# EAGLE design MCP23017_O8_v1_01 (EAGLE 9.6.2)
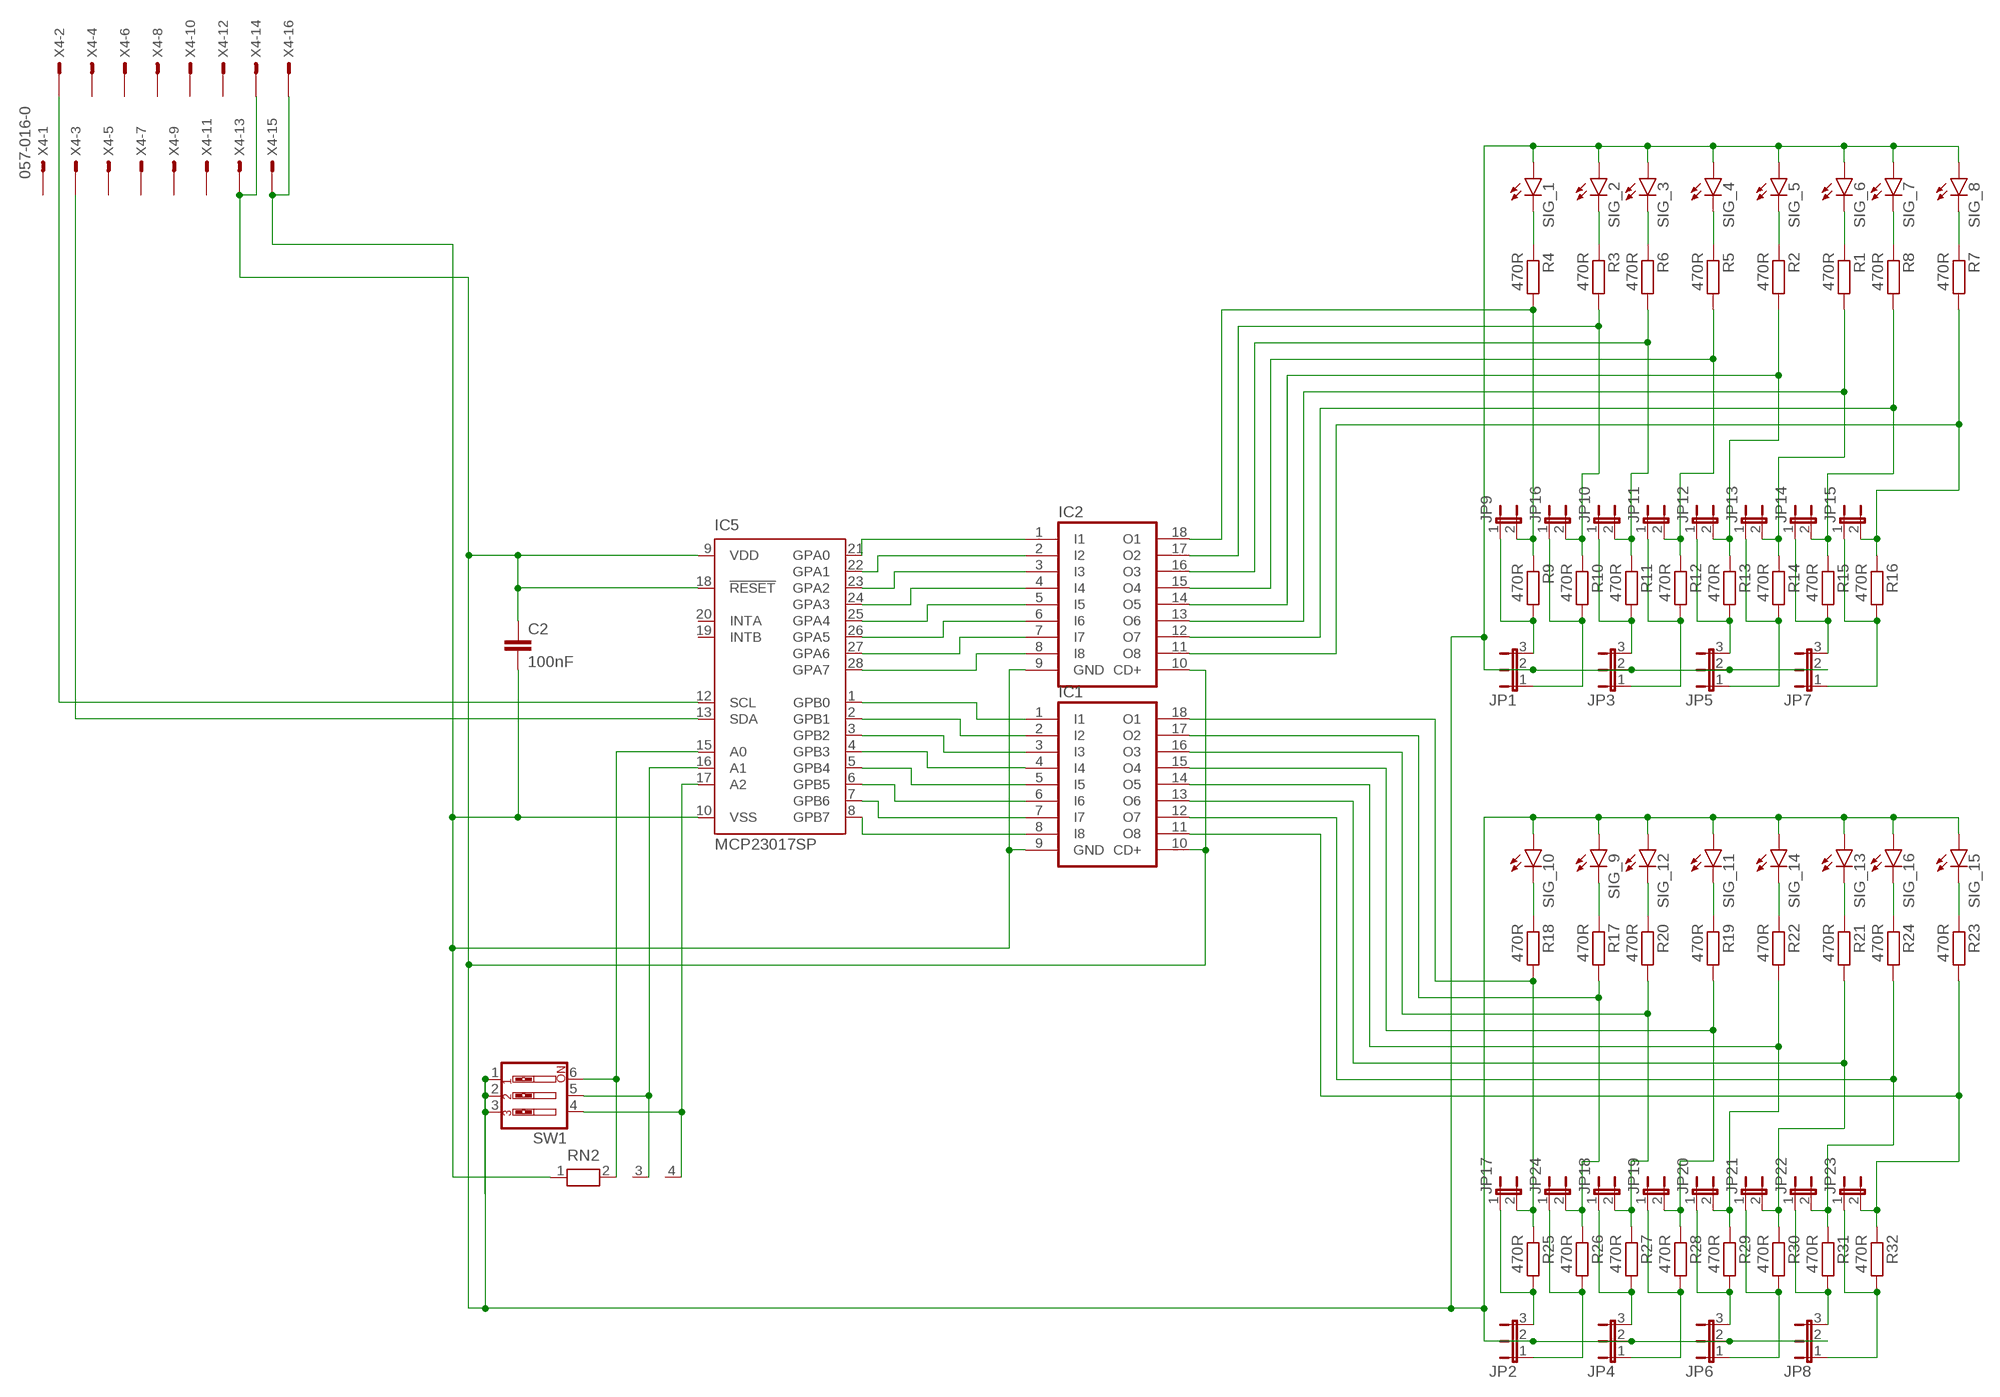
[diagram p0: schematic, sheet 1]

## Parts
C2  100nF  C-EU025-024X044  [C025-024X044]
IC1  ULN2803A  [DIL18]
IC2  ULN2803A  [DIL18]
IC5  MCP23017SP  [DIL28-3]
JP1  JP2E  [JP2]
JP2  JP2E  [JP2]
JP3  JP2E  [JP2]
JP4  JP2E  [JP2]
JP5  JP2E  [JP2]
JP6  JP2E  [JP2]
JP7  JP2E  [JP2]
JP8  JP2E  [JP2]
JP9  JP1E  [JP1]
JP10  JP1E  [JP1]
JP11  JP1E  [JP1]
JP12  JP1E  [JP1]
JP13  JP1E  [JP1]
JP14  JP1E  [JP1]
JP15  JP1E  [JP1]
JP16  JP1E  [JP1]
JP17  JP1E  [JP1]
JP18  JP1E  [JP1]
JP19  JP1E  [JP1]
JP20  JP1E  [JP1]
JP21  JP1E  [JP1]
JP22  JP1E  [JP1]
JP23  JP1E  [JP1]
JP24  JP1E  [JP1]
R1  470R  R-EU_0309/10  [0309/10]
R2  470R  R-EU_0309/10  [0309/10]
R3  470R  R-EU_0309/10  [0309/10]
R4  470R  R-EU_0309/10  [0309/10]
R5  470R  R-EU_0309/10  [0309/10]
R6  470R  R-EU_0309/10  [0309/10]
R7  470R  R-EU_0309/10  [0309/10]
R8  470R  R-EU_0309/10  [0309/10]
R9  470R  R-EU_0309/10  [0309/10]
R10  470R  R-EU_0309/10  [0309/10]
R11  470R  R-EU_0309/10  [0309/10]
R12  470R  R-EU_0309/10  [0309/10]
R13  470R  R-EU_0309/10  [0309/10]
R14  470R  R-EU_0309/10  [0309/10]
R15  470R  R-EU_0309/10  [0309/10]
R16  470R  R-EU_0309/10  [0309/10]
R17  470R  R-EU_0309/10  [0309/10]
R18  470R  R-EU_0309/10  [0309/10]
R19  470R  R-EU_0309/10  [0309/10]
R20  470R  R-EU_0309/10  [0309/10]
R21  470R  R-EU_0309/10  [0309/10]
R22  470R  R-EU_0309/10  [0309/10]
R23  470R  R-EU_0309/10  [0309/10]
R24  470R  R-EU_0309/10  [0309/10]
R25  470R  R-EU_0309/10  [0309/10]
R26  470R  R-EU_0309/10  [0309/10]
R27  470R  R-EU_0309/10  [0309/10]
R28  470R  R-EU_0309/10  [0309/10]
R29  470R  R-EU_0309/10  [0309/10]
R30  470R  R-EU_0309/10  [0309/10]
R31  470R  R-EU_0309/10  [0309/10]
R32  470R  R-EU_0309/10  [0309/10]
RN2  RN03  [RN-3]
SIG_1  LED3MM  [LED3MM]
SIG_2  LED3MM  [LED3MM]
SIG_3  LED3MM  [LED3MM]
SIG_4  LED3MM  [LED3MM]
SIG_5  LED3MM  [LED3MM]
SIG_6  LED3MM  [LED3MM]
SIG_7  LED3MM  [LED3MM]
SIG_8  LED3MM  [LED3MM]
SIG_9  LED3MM  [LED3MM]
SIG_10  LED3MM  [LED3MM]
SIG_11  LED3MM  [LED3MM]
SIG_12  LED3MM  [LED3MM]
SIG_13  LED3MM  [LED3MM]
SIG_14  LED3MM  [LED3MM]
SIG_15  LED3MM  [LED3MM]
SIG_16  LED3MM  [LED3MM]
SW1  SW_DIP-3  [EDG-03]
X4  057-016-0  [057-016-0]

## Nets
GND2: C2.2 IC1.9(GND) IC2.9(GND) IC5.10(VSS) RN2.1 X4.15 X4.16
N$1: JP1.3 JP9.1 R9.2
N$2: IC2.18(O1) JP9.2 R4.2 R9.1
N$3: R2.1 SIG_5.K(C)
N$4: R1.1 SIG_6.K(C)
N$5: IC2.1(I1) IC5.21(GPA0)
N$6: IC5.17(A2) RN2.4 SW1.4
N$7: R8.1 SIG_7.K(C)
N$8: R7.1 SIG_8.K(C)
N$9: JP1.1 JP16.1 R10.2
N$10: JP3.3 JP10.1 R11.2
N$11: JP3.1 JP11.1 R12.2
N$12: IC2.16(O3) JP10.2 R6.2 R11.1
N$13: JP5.3 JP12.1 R13.2
N$14: IC2.14(O5) JP12.2 R2.2 R13.1
N$16: IC1.17(O2) JP24.2 R17.2 R26.1
N$17: IC1.15(O4) JP19.2 R19.2 R28.1
N$18: IC1.14(O5) JP20.2 R22.2 R29.1
N$20: IC1.18(O1) JP17.2 R18.2 R25.1
N$22: IC2.17(O2) JP16.2 R3.2 R10.1
N$24: IC2.15(O4) JP11.2 R5.2 R12.1
N$25: IC2.2(I2) IC5.22(GPA1)
N$27: IC2.3(I3) IC5.23(GPA2)
N$29: IC2.4(I4) IC5.24(GPA3)
N$30: JP5.1 JP13.1 R14.2
N$31: IC2.5(I5) IC5.25(GPA4)
N$32: JP7.3 JP14.1 R15.2
N$33: JP7.1 JP15.1 R16.2
N$34: IC2.6(I6) IC5.26(GPA5)
N$35: IC5.16(A1) RN2.3 SW1.5
N$36: R4.1 SIG_1.K(C)
N$37: R3.1 SIG_2.K(C)
N$38: IC2.7(I7) IC5.27(GPA6)
N$39: IC2.8(I8) IC5.28(GPA7)
N$40: IC1.1(I1) IC5.1(GPB0)
N$41: IC1.2(I2) IC5.2(GPB1)
N$42: IC1.3(I3) IC5.3(GPB2)
N$43: IC1.4(I4) IC5.4(GPB3)
N$44: IC1.5(I5) IC5.5(GPB4)
N$45: IC1.6(I6) IC5.6(GPB5)
N$46: IC1.7(I7) IC5.7(GPB6)
N$47: IC1.8(I8) IC5.8(GPB7)
N$50: IC1.13(O6) JP21.2 R21.2 R30.1
N$51: IC1.16(O3) JP18.2 R20.2 R27.1
N$52: IC1.12(O7) JP22.2 R24.2 R31.1
N$53: R6.1 SIG_3.K(C)
N$54: R5.1 SIG_4.K(C)
N$55: IC1.11(O8) JP23.2 R23.2 R32.1
N$57: IC2.13(O6) JP13.2 R1.2 R14.1
N$58: IC2.12(O7) JP14.2 R8.2 R15.1
N$59: IC2.11(O8) JP15.2 R7.2 R16.1
N$61: R18.1 SIG_10.K(C)
N$62: R17.1 SIG_9.K(C)
N$66: R20.1 SIG_12.K(C)
N$67: R19.1 SIG_11.K(C)
N$69: R22.1 SIG_14.K(C)
N$70: R21.1 SIG_13.K(C)
N$72: R24.1 SIG_16.K(C)
N$73: R23.1 SIG_15.K(C)
N$74: JP2.3 JP17.1 R25.2
N$75: JP2.1 JP24.1 R26.2
N$76: JP4.3 JP18.1 R27.2
N$77: JP4.1 JP19.1 R28.2
N$78: JP6.3 JP20.1 R29.2
N$79: JP6.1 JP21.1 R30.2
N$80: JP8.3 JP22.1 R31.2
N$81: JP8.1 JP23.1 R32.2
N$82: IC5.12(SCL) X4.2
N$84: IC5.13(SDA) X4.3
N$85: IC5.15(A0) RN2.2 SW1.6
VCC5.1: C2.1 IC1.10(CD+) IC2.10(CD+) IC5.9(VDD) IC5.18(!RESET) JP1.2 JP2.2 JP3.2 JP4.2 JP5.2 JP6.2 JP7.2 JP8.2 SIG_1.A SIG_2.A SIG_3.A SIG_4.A SIG_5.A SIG_6.A SIG_7.A SIG_8.A SIG_9.A SIG_10.A SIG_11.A SIG_12.A SIG_13.A SIG_14.A SIG_15.A SIG_16.A SW1.1 SW1.2 SW1.3 X4.13 X4.14
Unconnected: IC5.19(INTB) IC5.20(INTA) X4.1 X4.4 X4.5 X4.6 X4.7 X4.8 X4.9 X4.10 X4.11 X4.12

## Library data of the parts
C2 = resistor:C-EU: CAPACITOR, European symbol
IC1 IC2 = uln-udn:ULN2803A: DRIVER ARRAY
IC5 = microchip-6:MCP23017: http://ww1.microchip.com/downloads/en/DeviceDoc/21952a.pdf Source: http://ww1.microchip.com/downloads/en/DeviceDoc/21952a.pdf
JP1-JP8 = jumper:JP2E: JUMPER
JP9-JP24 = jumper:JP1E: JUMPER
R1-R32 = resistor:R-EU_: RESISTOR, European symbol
RN2 = resistor-net_edit:RN03: RESISTOR NETWORK; OC_FARNELL: unknown; OC_NEWARK: unknown
SIG_1-SIG_16 = led:LED: LED OSRAM: - CHIPLED LG R971, LG N971, LY N971, LG Q971, LY Q971, LO R971, LY R971 LH N974, LH R974 LS Q976, LO Q976, LY Q976 LO Q996 - Hyper CHIPLED LW Q18S LB Q993, LB Q99A, LB R99A - SideLED LS A670, LO A670, LY A670, LG A670, LP A670 LB A673, LV A673, LT A673, LW A673 LH A674 LY A675 LS A676, LA A676, LO A676, LY A676, LW A676 LS A679, LY A679, LG A679 - Hyper Micro SIDELED® LS Y876, LA Y876, LO Y876, LY Y876 LT Y87S - SmartLED LW L88C, LW L88S LB L89C, LB L89S, LG L890 LS L89K, LO L89K, LY L89K LS L896, LA L896, LO L896, LY L896 - TOPLED LS T670, LO T670, LY T670, LG T670, LP T670 LSG T670, LSP T670, LSY T670, LOP T670, LYG T670 LG T671, LOG T671, LSG T671 LB T673, LV T673, LT T673, LW T673 LH T674 LS T676, LA T676, LO T676, LY T676, LB T676, LH T676, LSB T676, LW T676 LB T67C, LV T67C, LT T67C, LS T67K, LO T67K, LY T67K, LW E67C LS E67B, LA E67B, LO E67B, LY E67B, LB E67C, LV E67C, LT E67C LW T67C LS T679, LY T679, LG T679 LS T770, LO T770, LY T770, LG T770, LP T770 LB T773, LV T773, LT T773, LW T773 LH T774 LS E675, LA E675, LY E675, LS T675 LS T776, LA T776, LO T776, LY T776, LB T776 LHGB T686 LT T68C, LB T68C - Hyper Mini TOPLED® LB M676 - Mini TOPLED Santana® LG M470 LS M47K, LO M47K, LY M47K Source: http://www.osram.convergy.de LUXEON: - LUMILED® LXK2-PW12-R00, LXK2-PW12-S00, LXK2-PW14-U00, LXK2-PW14-V00 LXK2-PM12-R00, LXK2-PM12-S00, LXK2-PM14-U00 LXK2-PE12-Q00, LXK2-PE12-R00, LXK2-PE12-S00, LXK2-PE14-T00, LXK2-PE14-U00 LXK2-PB12-K00, LXK2-PB12-L00, LXK2-PB12-M00, LXK2-PB14-N00, LXK2-PB14-P00, LXK2-PB14-Q00 LXK2-PR12-L00, LXK2-PR12-M00, LXK2-PR14-Q00, LXK2-PR14-R00 LXK2-PD12-Q00, LXK2-PD12-R00, LXK2-PD12-S00 LXK2-PH12-R00, LXK2-PH12-S00 LXK2-PL12-P00, LXK2-PL12-Q00, LXK2-PL12-R00 Source: www.luxeon.com KINGBRIGHT: KA-3528ASYC Source: www.kingbright.com
SW1 = special:SW_DIP-3: DIP SWITCH
X4 = con-panduit:057-016-: CONNECTOR 10-pin series 057 contact pc board low profile headers; OC_FARNELL: unknown; OC_NEWARK: unknown

## Board
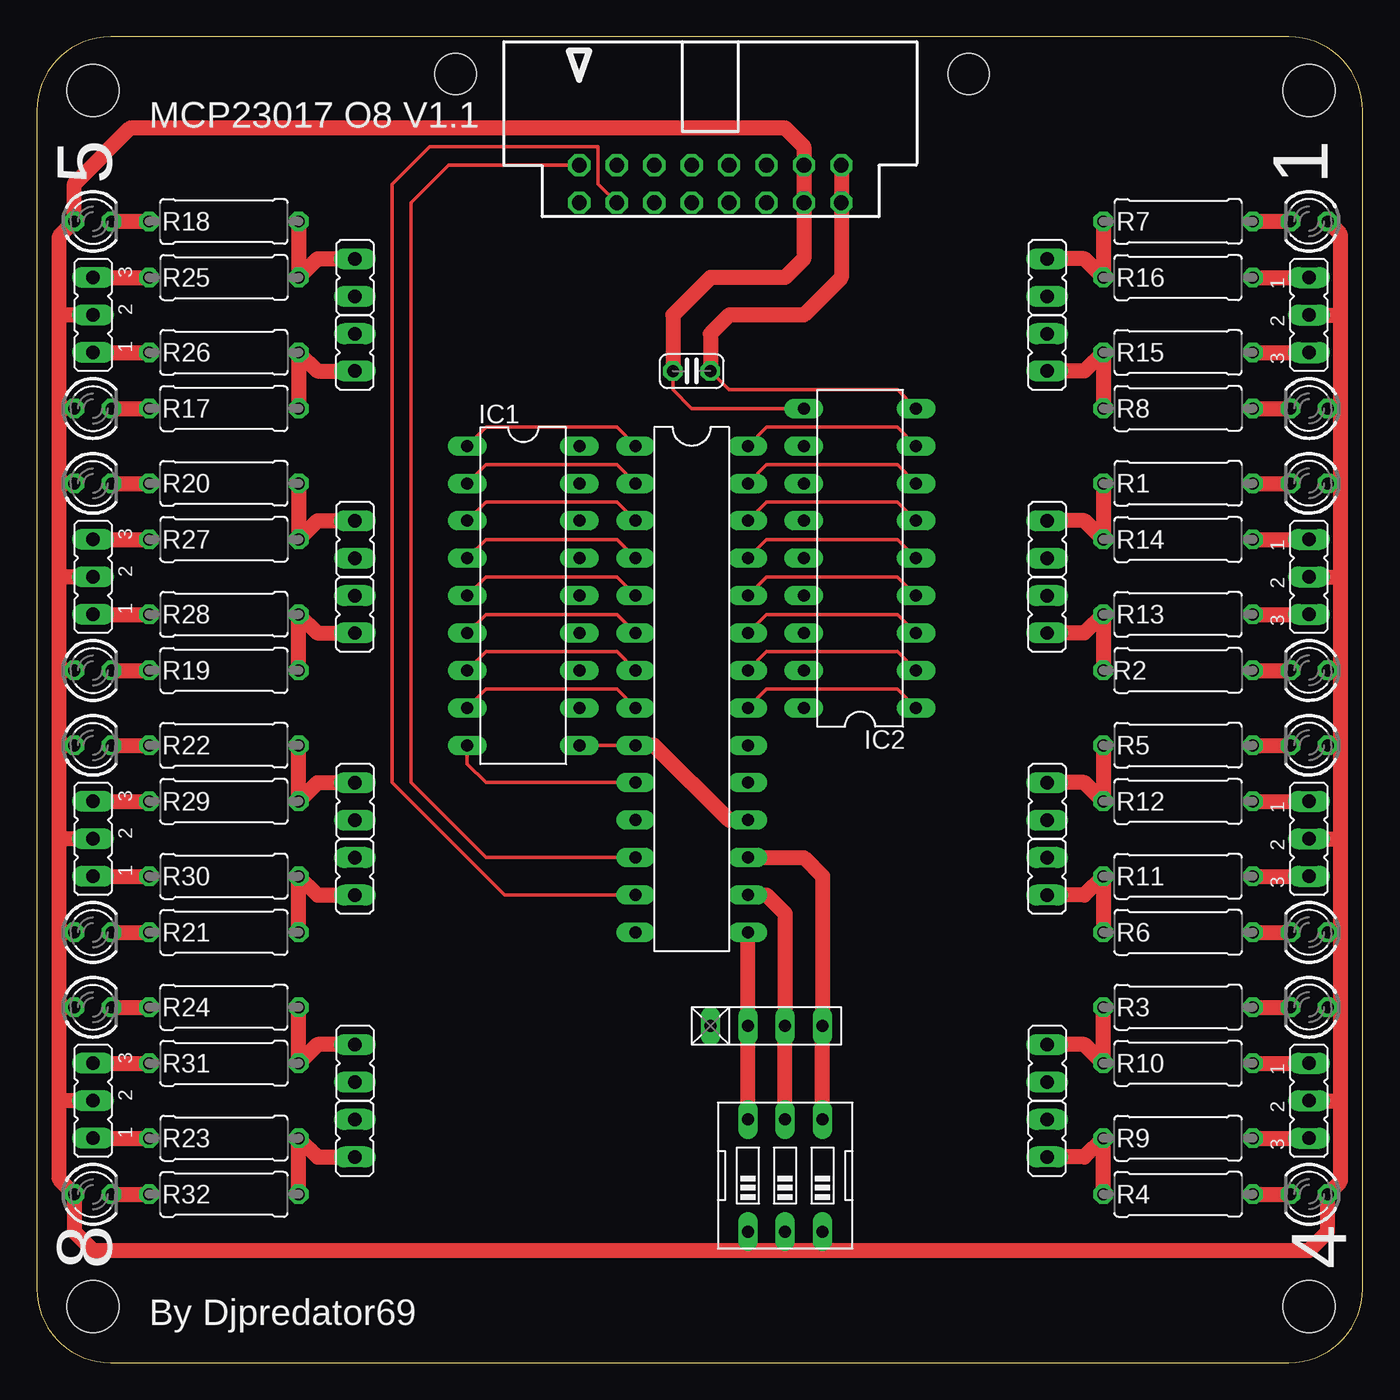
[diagram p1: board, top side]
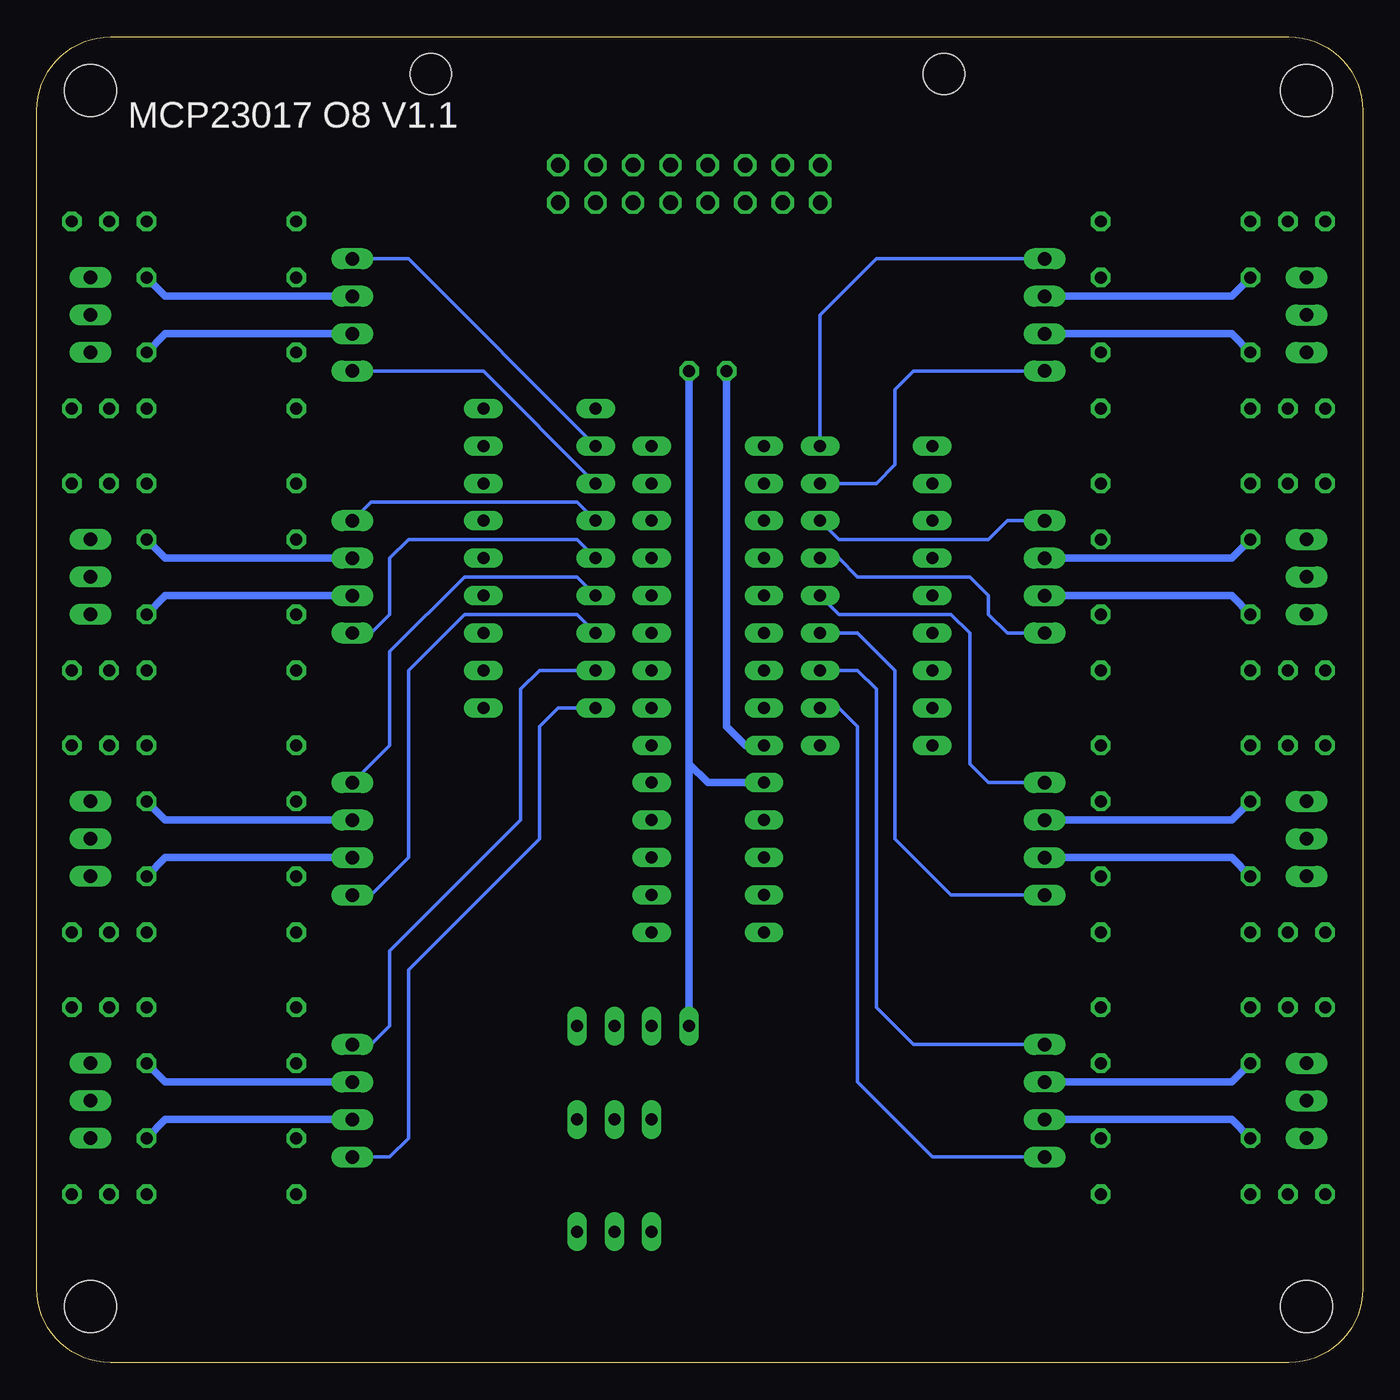
[diagram p2: board, bottom side, seen from below]

Size 90 x 90 mm. Coordinates in mm from the lower left corner, seen from the top.
Outline: 0,85 0,5 arc90 5,0 85,0 arc90 90,5 90,85 arc90 85,90 5,90 arc90 0,85
Copper layers (1*16): Top 0.035mm / dielectric 1.5mm / Bottom 0.035mm
Design rules "default": minimum track width 6mil, minimum drill 0.35mm, track to track 6mil, track to pad 6mil, pad to pad 6mil, via to via 6mil, smd to smd 6mil, copper to edge 40mil, drill to drill 6mil, minimum pad ring 10mil, minimum via ring 8mil, stop-mask expansion 4mil, vias tented up to drill 0mil, thermal gap 10mil
Holes 3.5 mm at 86.36,86.36 3.81,86.36 3.81,3.81 86.36,3.81

### Footprints (pad centres in the part's own frame; a part is rotated, then mirrored left to right if it is on the bottom)
C025-024X044 = drill 0.813 octagon: 1 -1.27,0; 2 1.27,0
DIL18 = drill 0.813 long: 1 -10.16,-3.81; 2 -7.62,-3.81; 3 -5.08,-3.81; 4 -2.54,-3.81; 5 0,-3.81; 6 2.54,-3.81; 7 5.08,-3.81; 8 7.62,-3.81; 9 10.16,-3.81; 10 10.16,3.81; 11 7.62,3.81; 12 5.08,3.81; 13 2.54,3.81; 14 0,3.81; 15 -2.54,3.81; 16 -5.08,3.81; 17 -7.62,3.81; 18 -10.16,3.81
DIL28-3 = drill 0.813 long: 1 -16.51,-3.81; 2 -13.97,-3.81; 3 -11.43,-3.81; 4 -8.89,-3.81; 5 -6.35,-3.81; 6 -3.81,-3.81; 7 -1.27,-3.81; 8 1.27,-3.81; 9 3.81,-3.81; 10 6.35,-3.81; 11 8.89,-3.81; 12 11.43,-3.81; 13 13.97,-3.81; 14 16.51,-3.81; 15 16.51,3.81; 16 13.97,3.81; 17 11.43,3.81; 18 8.89,3.81; 19 6.35,3.81; 20 3.81,3.81; 21 1.27,3.81; 22 -1.27,3.81; 23 -3.81,3.81; 24 -6.35,3.81; 25 -8.89,3.81; 26 -11.43,3.81; 27 -13.97,3.81; 28 -16.51,3.81
JP2 = drill 0.914 long: 1 -2.54,0; 2 0,0; 3 2.54,0
JP1 = drill 0.914 long: 1 0,-1.27; 2 0,1.27
0309/10 = drill 0.813 octagon: 1 -5.08,0; 2 5.08,0
RN-3 = drill 0.813 long: 1 -5.08,0; 2 -2.54,0; 3 0,0; 4 2.54,0
LED3MM = drill 0.813 octagon: A -1.27,0; K 1.27,0
EDG-03 = drill 0.813 long: 1 -2.54,-3.81; 2 0,-3.81; 3 2.54,-3.81; 4 2.54,3.81; 5 0,3.81; 6 -2.54,3.81
057-016-0 = drill 1 octagon: 1 -8.89,-5.08; 2 -8.89,-2.54; 3 -6.35,-5.08; 4 -6.35,-2.54; 5 -3.81,-5.08; 6 -3.81,-2.54; 7 -1.27,-5.08; 8 -1.27,-2.54; 9 1.27,-5.08; 10 1.27,-2.54; 11 3.81,-5.08; 12 3.81,-2.54; 13 6.35,-5.08; 14 6.35,-2.54; 15 8.89,-5.08; 16 8.89,-2.54 | hole 2.8: -17.29,3.66; 17.54,3.66

### Placement (x,y rotation side)
C2  44.45,67.31 0 top
IC1  33.02,52.07 270 top
IC2  55.88,54.61 90 top
IC5  44.45,45.72 270 top
JP1  86.36,17.78 270 top
JP2  3.81,71.12 90 top
JP3  86.36,35.56 270 top
JP4  3.81,53.34 90 top
JP5  86.36,53.34 270 top
JP6  3.81,35.56 90 top
JP7  86.36,71.12 270 top
JP8  3.81,17.78 90 top
JP9  68.58,15.24 180 top
JP10  68.58,33.02 180 top
JP11  68.58,38.1 0 top
JP12  68.58,50.8 180 top
JP13  68.58,55.88 0 top
JP14  68.58,68.58 180 top
JP15  68.58,73.66 0 top
JP16  68.58,20.32 0 top
JP17  21.59,73.66 0 top
JP18  21.59,55.88 0 top
JP19  21.59,50.8 180 top
JP20  21.59,38.1 0 top
JP21  21.59,33.02 180 top
JP22  21.59,20.32 0 top
JP23  21.59,15.24 180 top
JP24  21.59,68.58 180 top
R1  77.47,59.69 180 top
R2  77.47,46.99 180 top
R3  77.47,24.13 180 top
R4  77.47,11.43 180 top
R5  77.47,41.91 180 top
R6  77.47,29.21 180 top
R7  77.47,77.47 180 top
R8  77.47,64.77 180 top
R9  77.47,15.24 0 top
R10  77.47,20.32 0 top
R11  77.47,33.02 0 top
R12  77.47,38.1 0 top
R13  77.47,50.8 0 top
R14  77.47,55.88 0 top
R15  77.47,68.58 0 top
R16  77.47,73.66 0 top
R17  12.7,64.77 0 top
R18  12.7,77.47 0 top
R19  12.7,46.99 0 top
R20  12.7,59.69 0 top
R21  12.7,29.21 0 top
R22  12.7,41.91 0 top
R23  12.7,11.43 0 top
R24  12.7,24.13 0 top
R25  12.7,73.66 180 top
R26  12.7,68.58 180 top
R27  12.7,55.88 180 top
R28  12.7,50.8 180 top
R29  12.7,38.1 180 top
R30  12.7,33.02 180 top
R31  12.7,20.32 180 top
R32  12.7,15.24 180 top
RN2  50.8,22.86 0 top
SIG_1  86.36,11.43 180 top
SIG_2  86.36,24.13 180 top
SIG_3  86.36,29.21 180 top
SIG_4  86.36,41.91 180 top
SIG_5  86.36,46.99 180 top
SIG_6  86.36,59.69 180 top
SIG_7  86.36,64.77 180 top
SIG_8  86.36,77.47 180 top
SIG_9  3.81,64.77 0 top
SIG_10  3.81,77.47 0 top
SIG_11  3.81,46.99 0 top
SIG_12  3.81,59.69 0 top
SIG_13  3.81,29.21 0 top
SIG_14  3.81,41.91 0 top
SIG_15  3.81,11.43 0 top
SIG_16  3.81,24.13 0 top
SW1  50.8,12.7 0 top
X4  45.72,83.82 0 top

### Tracks (layer width: path | path; a pad name or v marks a point on that pad's centre or on a via)
GND2
  Top 0.254: IC2.9 58.42,66.04 46.99,66.04 C2.2 | IC5.10 30.48,39.37 29.21,40.64 IC1.9
  Top 1.016: X4.16 X4.15 54.61,73.66 52.07,71.12 46.99,71.12 45.72,69.85 C2.2
  Bottom 0.508: C2.2 45.72,40.64 | 45.72,40.64 44.45,39.37 IC5.10 | RN2.1 45.72,40.64
N$1
  Top 1.016: R9.2 JP1.3
  Bottom 0.508: JP9.1 81.28,16.51 R9.2
N$2
  Top 1.016: R4.2 R9.1 71.12,13.97 JP9.2
  Bottom 0.254: IC2.18 54.61,44.45 55.88,43.18 55.88,35.56 64.77,26.67 64.77,15.24 66.04,13.97 JP9.2
N$3
  Top 1.016: R2.1 SIG_5.K
N$4
  Top 1.016: R1.1 SIG_6.K
N$5
  Top 0.254: IC5.21 49.53,45.72 58.42,45.72 IC2.1
N$6
  Top 1.016: SW1.4 RN2.4 53.34,33.02 52.07,34.29 IC5.17
N$7
  Top 1.016: R8.1 SIG_7.K
N$8
  Top 1.016: R7.1 SIG_8.K
N$9
  Top 1.016: R10.2 JP1.1
  Bottom 0.508: JP16.1 81.28,19.05 R10.2
N$10
  Top 1.016: R11.2 JP3.3
  Bottom 0.508: JP10.1 81.28,34.29 R11.2
N$11
  Top 1.016: R12.2 JP3.1
  Bottom 0.508: JP11.1 81.28,36.83 R12.2
N$12
  Top 1.016: R6.2 R11.1 71.12,31.75 JP10.2
  Bottom 0.254: IC2.16 53.34,50.8 60.96,50.8 64.77,46.99 64.77,34.29 67.31,31.75 JP10.2
N$13
  Top 1.016: R13.2 JP5.3
  Bottom 0.508: JP12.1 81.28,52.07 R13.2
N$14
  Top 1.016: R2.2 R13.1 71.12,49.53 JP12.2
  Bottom 0.254: IC2.14 53.34,55.88 64.77,55.88 66.04,54.61 66.04,50.8 67.31,49.53 JP12.2
N$16
  Top 1.016: R17.2 R26.1 19.05,67.31 JP24.2
  Bottom 0.254: JP24.2 30.48,67.31 31.75,66.04 31.75,60.96 33.02,59.69 IC1.17
N$17
  Top 1.016: R19.2 R28.1 19.05,49.53 JP19.2
  Bottom 0.254: JP19.2 24.13,49.53 25.4,50.8 25.4,52.07 26.67,53.34 34.29,53.34 35.56,54.61 IC1.15
N$18
  Top 1.016: R22.2 R29.1 19.05,39.37 JP20.2
  Bottom 0.254: IC1.14 35.56,50.8 27.94,50.8 26.67,49.53 26.67,40.64 25.4,39.37 JP20.2
N$20
  Top 1.016: R18.2 R25.1 19.05,74.93 JP17.2
  Bottom 0.254: JP17.2 33.02,74.93 36.83,71.12 IC1.18
N$22
  Top 1.016: R3.2 R10.1 71.12,21.59 JP16.2
  Bottom 0.254: IC2.17 55.88,46.99 57.15,45.72 57.15,36.83 66.04,27.94 66.04,22.86 67.31,21.59 JP16.2
N$24
  Top 1.016: R5.2 R12.1 71.12,39.37 JP11.2
  Bottom 0.254: IC2.15 53.34,53.34 60.96,53.34 66.04,48.26 66.04,41.91 JP11.2
N$25
  Top 0.254: IC5.22 49.53,48.26 58.42,48.26 IC2.2
N$27
  Top 0.254: IC5.23 49.53,50.8 58.42,50.8 IC2.3
N$29
  Top 0.254: IC5.24 49.53,53.34 58.42,53.34 IC2.4
N$30
  Top 1.016: R14.2 JP5.1
  Bottom 0.508: JP13.1 81.28,54.61 R14.2
N$31
  Top 0.254: IC5.25 49.53,55.88 58.42,55.88 IC2.5
N$32
  Top 1.016: R15.2 JP7.3
  Bottom 0.508: JP14.1 81.28,69.85 R15.2
N$33
  Top 1.016: R16.2 JP7.1
  Bottom 0.508: JP15.1 81.28,72.39 R16.2
N$34
  Top 0.254: IC5.26 49.53,58.42 58.42,58.42 IC2.6
N$35
  Top 1.016: SW1.5 RN2.3 50.8,30.48 49.53,31.75 IC5.16
N$36
  Top 1.016: R4.1 SIG_1.K
N$37
  Top 1.016: R3.1 SIG_2.K
N$38
  Top 0.254: IC5.27 49.53,60.96 58.42,60.96 IC2.7
N$39
  Top 0.254: IC5.28 49.53,63.5 58.42,63.5 IC2.8
N$40
  Top 0.254: IC1.1 30.48,63.5 39.37,63.5 IC5.1
N$41
  Top 0.254: IC1.2 30.48,60.96 39.37,60.96 IC5.2
N$42
  Top 0.254: IC1.3 30.48,58.42 39.37,58.42 IC5.3
N$43
  Top 0.254: IC1.4 30.48,55.88 39.37,55.88 IC5.4
N$44
  Top 0.254: IC1.5 30.48,53.34 39.37,53.34 IC5.5
N$45
  Top 0.254: IC1.6 30.48,50.8 39.37,50.8 IC5.6
N$46
  Top 0.254: IC1.7 30.48,48.26 39.37,48.26 IC5.7
N$47
  Top 0.254: IC1.8 30.48,45.72 39.37,45.72 IC5.8
N$50
  Top 1.016: R21.2 R30.1 19.05,31.75 JP21.2
  Bottom 0.254: JP21.2 27.94,31.75 31.75,35.56 31.75,46.99 34.29,49.53 IC1.13
N$51
  Top 1.016: R20.2 R27.1 19.05,57.15 JP18.2
  Bottom 0.254: IC1.16 35.56,55.88 25.4,55.88 24.13,57.15 JP18.2
N$52
  Top 1.016: R24.2 R31.1 19.05,21.59 JP22.2
  Bottom 0.254: IC1.12 34.29,46.99 33.02,45.72 33.02,24.13 30.48,21.59 JP22.2
N$53
  Top 1.016: R6.1 SIG_3.K
N$54
  Top 1.016: R5.1 SIG_4.K
N$55
  Top 1.016: R23.2 R32.1 19.05,13.97 JP23.2
  Bottom 0.254: JP23.2 29.21,13.97 34.29,19.05 34.29,43.18 35.56,44.45 IC1.11
N$57
  Top 1.016: R1.2 R14.1 71.12,57.15 JP13.2
  Bottom 0.254: IC2.13 53.34,58.42 67.31,58.42 JP13.2
N$58
  Top 1.016: R8.2 R15.1 71.12,67.31 JP14.2
  Bottom 0.254: IC2.12 59.69,67.31 JP14.2
N$59
  Top 1.016: R7.2 R16.1 71.12,74.93 JP15.2
  Bottom 0.254: IC2.11 64.77,74.93 JP15.2
N$61
  Top 1.016: SIG_10.K R18.1
N$62
  Top 1.016: SIG_9.K R17.1
N$66
  Top 1.016: SIG_12.K R20.1
N$67
  Top 1.016: SIG_11.K R19.1
N$69
  Top 1.016: SIG_14.K R22.1
N$70
  Top 1.016: SIG_13.K R21.1
N$72
  Top 1.016: SIG_16.K R24.1
N$73
  Top 1.016: SIG_15.K R23.1
N$74
  Top 1.016: JP2.3 R25.2
  Bottom 0.508: JP17.1 8.89,72.39 R25.2
N$75
  Top 1.016: JP2.1 R26.2
  Bottom 0.508: JP24.1 8.89,69.85 R26.2
N$76
  Top 1.016: JP4.3 R27.2
  Bottom 0.508: JP18.1 8.89,54.61 R27.2
N$77
  Top 1.016: JP4.1 R28.2
  Bottom 0.508: JP19.1 8.89,52.07 R28.2
N$78
  Top 1.016: JP6.3 R29.2
  Bottom 0.508: JP20.1 8.89,36.83 R29.2
N$79
  Top 1.016: JP6.1 R30.2
  Bottom 0.508: JP21.1 8.89,34.29 R30.2
N$80
  Top 1.016: JP8.3 R31.2
  Bottom 0.508: JP22.1 8.89,19.05 R31.2
N$81
  Top 1.016: JP8.1 R32.2
  Bottom 0.508: JP23.1 8.89,16.51 R32.2
N$82
  Top 0.254: X4.2 27.94,81.28 25.4,78.74 25.4,39.37 30.48,34.29 IC5.12
N$84
  Top 0.254: IC5.13 31.75,31.75 24.13,39.37 24.13,80.01 26.67,82.55 38.1,82.55 38.1,80.01 X4.3
N$85
  Top 1.016: SW1.6 RN2.2 IC5.15
VCC5.1
  Top 0.254: IC2.10 44.45,64.77 43.18,66.04 C2.1 | IC1.10 IC5.9
  Top 1.016: 1.52,17.78 1.52,12.45 SIG_15.A 2.54,8.89 3.81,7.62 48.26,7.62 | 1.52,17.78 1.52,24.13 | 1.52,24.13 1.52,29.21 | 1.52,29.21 1.52,35.56 | 1.52,35.56 1.52,41.91 | 1.52,41.91 1.52,46.99 | 1.52,46.99 1.52,53.34 | 1.52,53.34 1.52,59.69 | 1.52,59.69 1.52,64.77 | 1.52,64.77 1.52,71.12 | 1.52,71.12 1.52,76.45 SIG_10.A 2.54,80.01 6.35,83.82 50.8,83.82 52.07,82.55 X4.14 X4.13 52.07,74.93 50.8,73.66 45.72,73.66 43.18,71.12 C2.1 | JP2.2 1.52,71.12 | SIG_9.A 1.52,64.77 | SIG_12.A 1.52,59.69 | SIG_11.A 1.52,46.99 | JP4.2 1.52,53.34 | SIG_14.A 1.52,41.91 | JP6.2 1.52,35.56 | SIG_16.A 1.52,24.13 | SIG_13.A 1.52,29.21 | JP8.2 1.52,17.78 | SIG_8.A 88.48,76.62 88.48,71.12 | 88.48,71.12 88.48,64.77 | 88.48,64.77 88.48,59.69 | 88.48,59.69 88.48,53.34 | 88.48,53.34 88.48,46.99 | 88.48,46.99 88.48,41.91 | 88.48,41.91 88.48,35.56 | 88.48,35.56 88.48,29.21 | 88.48,29.21 88.48,24.13 | 88.48,24.13 88.48,17.78 | 88.48,17.78 88.48,12.28 SIG_1.A 87.63,8.89 86.36,7.62 53.34,7.62 | JP1.2 88.48,17.78 | SIG_2.A 88.48,24.13 | SIG_3.A 88.48,29.21 | JP3.2 88.48,35.56 | SIG_4.A 88.48,41.91 | SIG_5.A 88.48,46.99 | JP5.2 88.48,53.34 | SIG_6.A 88.48,59.69 | SIG_7.A 88.48,64.77 | JP7.2 88.48,71.12 | 48.26,7.62 50.8,7.62 | 50.8,7.62 53.34,7.62 | SW1.1 48.26,7.62 | SW1.2 50.8,7.62 | SW1.3 53.34,7.62 | IC5.18 46.99,36.83 41.91,41.91 IC5.9
  Bottom 0.508: C2.1 43.18,43.18 41.91,41.91 IC5.9

### Text on the board
tNames: MCP23017 O8 V1.1 | 5 | 1 | 8 | 4 | By Djpredator69
bNames: MCP23017 O8 V1.1